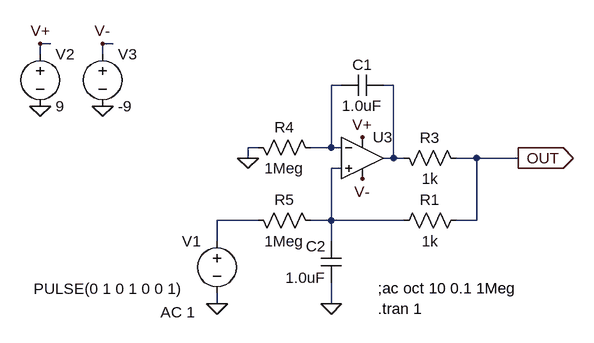
[diagram p0: schematic LME49600_HPA_Servo.asc]
LME49600_HPA_Servo.asc, the LTspice schematic file:
Version 4
SHEET 1 1064 680
WIRE -320 144 -336 144
WIRE -224 144 -240 144
WIRE -336 160 -336 144
WIRE -240 160 -240 144
WIRE 128 208 112 208
WIRE 208 208 192 208
WIRE 0 304 -16 304
WIRE 112 304 112 208
WIRE 112 304 80 304
WIRE 128 304 112 304
WIRE -16 320 -16 304
WIRE 208 320 208 208
WIRE 208 320 192 320
WIRE 224 320 208 320
WIRE 336 320 304 320
WIRE 400 320 336 320
WIRE 128 336 112 336
WIRE 0 416 -64 416
WIRE 112 416 112 336
WIRE 112 416 80 416
WIRE 224 416 112 416
WIRE 336 416 336 320
WIRE 336 416 304 416
WIRE -64 448 -64 416
WIRE 112 448 112 416
WIRE -64 544 -64 528
WIRE 112 544 112 512
FLAG -64 544 0
FLAG -336 240 0
FLAG -240 240 0
FLAG -336 144 V+
FLAG -240 144 V-
FLAG 112 544 0
FLAG -16 320 0
FLAG 160 288 V+
FLAG 160 352 V-
FLAG 400 320 OUT
IOPIN 400 320 Out
SYMBOL voltage -64 432 R0
WINDOW 123 -87 125 Left 2
WINDOW 39 0 0 Left 2
WINDOW 0 -54 16 Left 2
WINDOW 3 -282 89 Left 2
SYMATTR Value2 AC 1
SYMATTR InstName V1
SYMATTR Value PULSE(0 1 0 1 0 0 1)
SYMBOL voltage -336 144 R0
WINDOW 123 0 0 Left 2
WINDOW 39 0 0 Left 2
SYMATTR InstName V2
SYMATTR Value 9
SYMBOL voltage -240 144 R0
WINDOW 123 0 0 Left 2
WINDOW 39 0 0 Left 2
SYMATTR InstName V3
SYMATTR Value -9
SYMBOL res 208 304 M90
WINDOW 0 0 56 VBottom 2
WINDOW 3 32 56 VTop 2
SYMATTR InstName R3
SYMATTR Value 1k
SYMBOL Opamps\\UniversalOpamp2 160 320 R0
SYMATTR InstName U3
SYMBOL res -16 288 M90
WINDOW 0 0 56 VBottom 2
WINDOW 3 32 56 VTop 2
SYMATTR InstName R4
SYMATTR Value 1Meg
SYMBOL res -16 400 M90
WINDOW 0 0 56 VBottom 2
WINDOW 3 32 56 VTop 2
SYMATTR InstName R5
SYMATTR Value 1Meg
SYMBOL cap 128 192 M90
WINDOW 0 0 32 VBottom 2
WINDOW 3 32 32 VTop 2
SYMATTR InstName C1
SYMATTR Value 1.0uF
SYMBOL cap 128 448 M0
SYMATTR InstName C2
SYMATTR Value 1.0uF
SYMBOL res 320 400 R90
WINDOW 0 0 56 VBottom 2
WINDOW 3 32 56 VTop 2
SYMATTR InstName R1
SYMATTR Value 1k
TEXT 184 520 Left 2 !;ac oct 10 0.1 1Meg
TEXT 184 552 Left 2 !.tran 1

The netlist it stands for:
* LME49600_HPA_Servo.asc
V1 N004 0 PULSE(0 1 0 1 0 0 1) AC 1
V2 V+ 0 9
V3 V- 0 -9
R3 N002 OUT 1k
XU3 N003 N001 V+ V- N002 level.2 Avol=1Meg GBW=10Meg Slew=10Meg ilimit=25m rail=0 Vos=0 phimargin=45 en=0 enk=0 in=0 ink=0 Rin=500Meg  ; pins IN+ IN- V+ V- OUT
R4 0 N001 1Meg
R5 N004 N003 1Meg
C1 N001 N002 1.0uF
C2 N003 0 1.0uF
R1 OUT N003 1k
;ac oct 10 0.1 1Meg
.tran 1
.lib UniversalOpamps2.sub
.backanno
.end